# Altium schematic sheet dual_CAN_conn.SchDoc
size A4; SheetNumber: 4; SheetTotal: 11
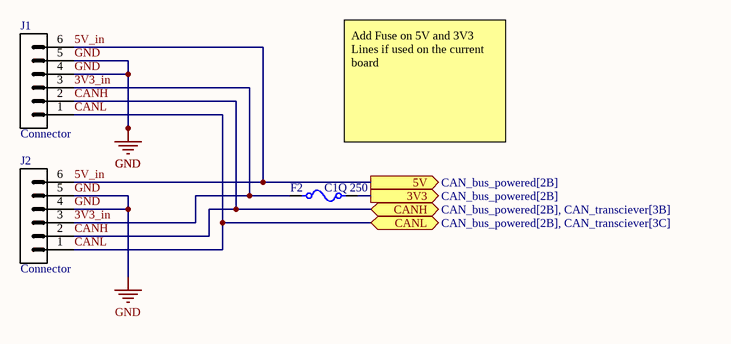
[diagram p0: dual_CAN_conn.SchDoc]

## Parts
F2  C1Q 250  [Chip2PinSM127P600-8N]
J1  Connector  [HRS_DF58-6P-1.2V(21)]
J2  Connector  [HRS_DF58-6P-1.2V(21)]

## Ports
3V3 (out, see CAN_bus_powered[2B]), 5V (out, see CAN_bus_powered[2B]), CANH (bidir, see CAN_bus_powered[2B], CAN_transciever[3B]), CANL (bidir, see CAN_bus_powered[2B], CAN_transciever[3C])

## Nets
GND: J1.4 J1.5 J2.4 J2.5
3V3: F2.2 ; port 3V3
3V3_in: F2.1 J1.3 J2.3
5V_in: J1.6 J2.6 ; port 5V
CANH: J1.2 J2.2 ; port CANH
CANL: J1.1 J2.1 ; port CANL

## Notes on the sheet
- Add Fuse on 5V and 3V3 Lines if used on the current board

## Library data of the parts
F2 = Fuse
J1 J2 = Connector 6-Pin 1 Row: 6 Pin 1 Row Connector